# EAGLE board base-6u-at91sam7s-eval-r2 (EAGLE 4.16), part 1 of 2
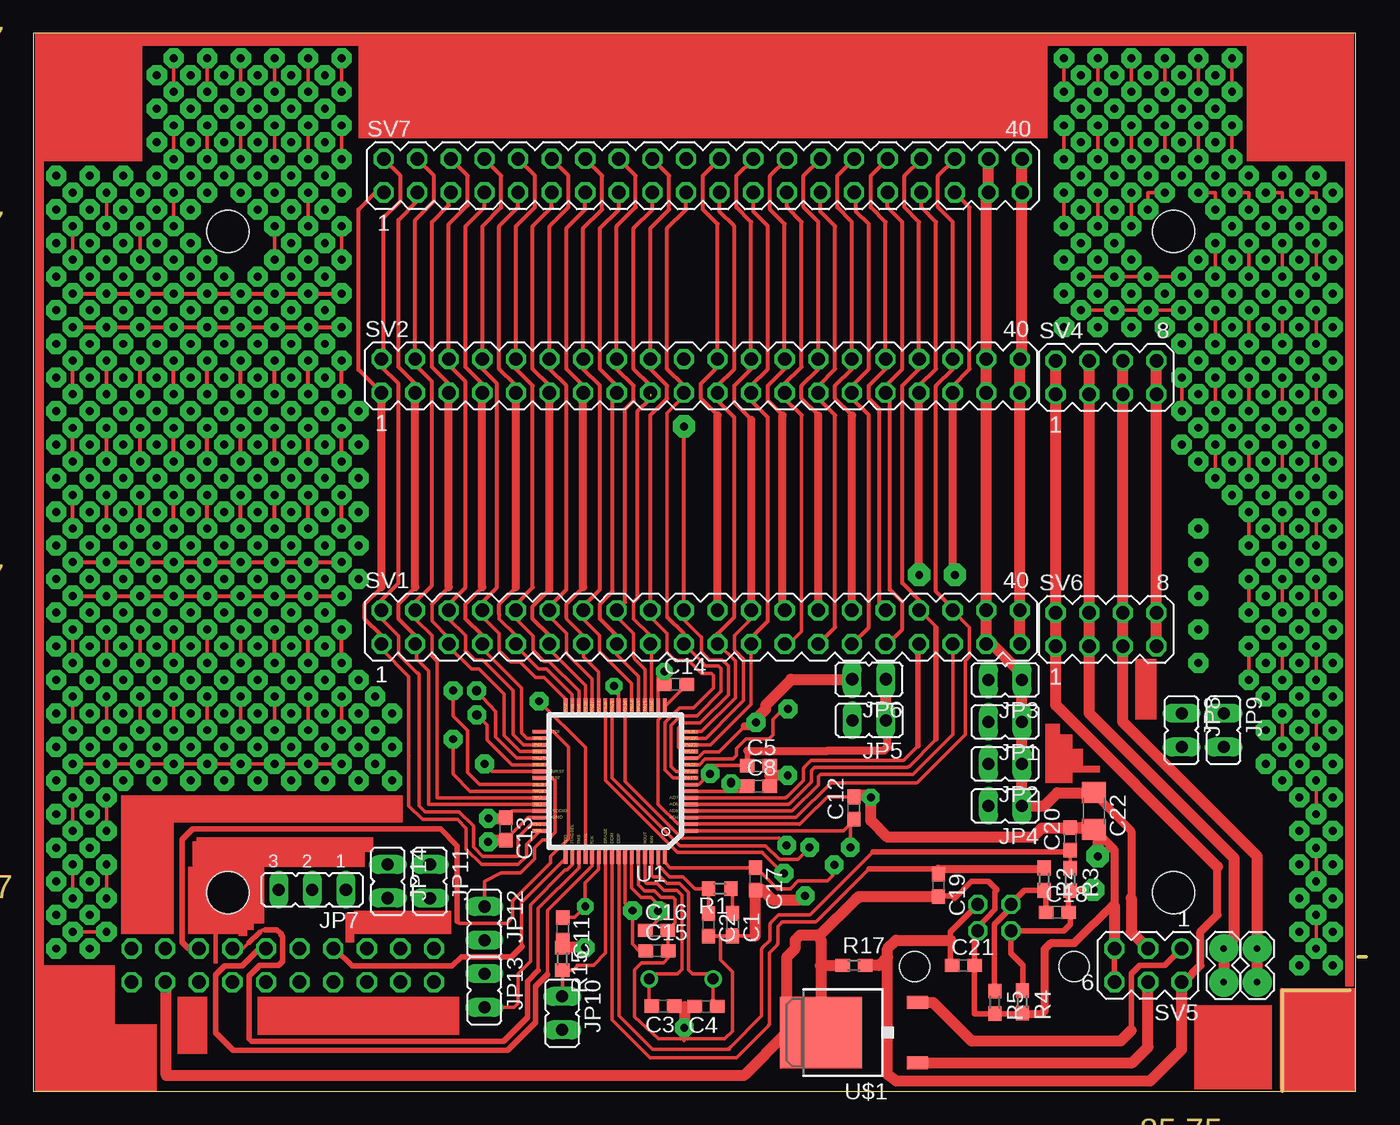
[diagram p1: board, top side]
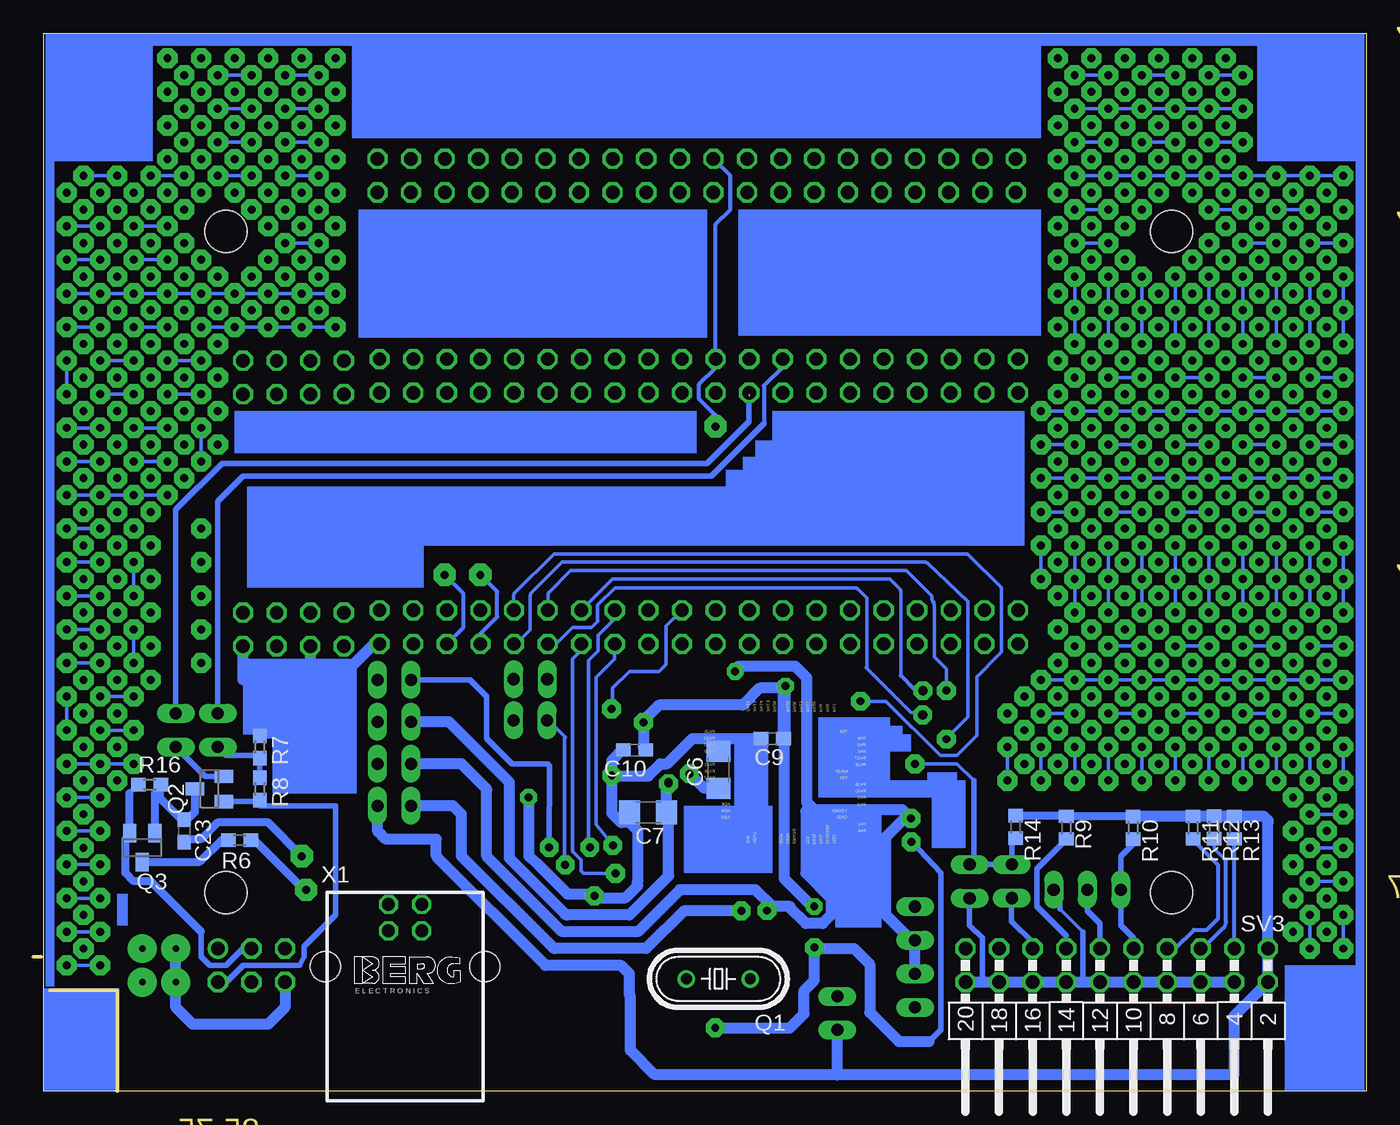
[diagram p2: board, bottom side, seen from below]

Size 100.8 x 80.01 mm. Coordinates in mm from the lower left corner, seen from the top.
Outline: 100.16,10.16 100.8,10.16
Outline: 99.53,7.62 94.45,7.62 94.45,0
Outline: 0,0.01 100,0.01 100,80.01 0,80.01 0,0.01
Copper layers (1*16): Top 0.035mm / dielectric 1.5mm / Bottom 0.035mm
Design rules "default": minimum track width 10mil, minimum drill 24mil, track to track 8mil, track to pad 8mil, pad to pad 8mil, via to via 8mil, smd to smd 8mil, copper to edge 40mil, drill to drill 8mil, minimum pad ring 10mil, minimum via ring 8mil, stop-mask expansion 4mil, vias tented up to drill 0mil, thermal gap 10mil
Holes 3.2 mm at 14.72,15.02 14.72,65.01 86.22,15.02 86.22,65.01

## Footprints (pad centres in the part's own frame; a part is rotated, then mirrored left to right if it is on the bottom)
C0603 = smd 1.1 x 1: 1 -0.85,0; 2 0.85,0
C1206 = smd 1.6 x 1.8: 1 -1.4,0; 2 1.4,0
JP1 = drill 0.914 long: 1 0,-1.27; 2 0,1.27
JP2 = drill 0.914 long: 1 -2.54,0; 2 0,0; 3 2.54,0
HC49/S = drill 0.813 round: 1 -2.413,0; 2 2.413,0
SOT23 = smd 1 x 1.4: 1 -0.95,-1.1; 2 0.95,-1.1; 3 0,1.1
R0603 = smd 1 x 1.1: 1 -0.85,0; 2 0.85,0
R0603' = smd 1.1 x 1: 1 -0.85,0; 2 0.85,0
MA20-2 = drill 1.016 octagon: 1 -24.13,-1.27; 2 -24.13,1.27; 3 -21.59,-1.27; 4 -21.59,1.27; 5 -19.05,-1.27; 6 -19.05,1.27; 7 -16.51,-1.27; 8 -16.51,1.27; 9 -13.97,-1.27; 10 -13.97,1.27; 11 -11.43,-1.27; 12 -11.43,1.27; 13 -8.89,-1.27; 14 -8.89,1.27; 15 -6.35,-1.27; 16 -6.35,1.27; 17 -3.81,-1.27; 18 -3.81,1.27; 19 -1.27,-1.27; 20 -1.27,1.27; 21 1.27,-1.27; 22 1.27,1.27; 23 3.81,-1.27; 24 3.81,1.27; 25 6.35,-1.27; 26 6.35,1.27; 27 8.89,-1.27; 28 8.89,1.27; 29 11.43,-1.27; 30 11.43,1.27; 31 13.97,-1.27; 32 13.97,1.27; 33 16.51,-1.27; 34 16.51,1.27; 35 19.05,-1.27; 36 19.05,1.27; 37 21.59,-1.27; 38 21.59,1.27; 39 24.13,-1.27; 40 24.13,1.27
MA10-2W = drill 1.016 octagon: 1 -11.43,-1.27; 2 -11.43,1.27; 3 -8.89,-1.27; 4 -8.89,1.27; 5 -6.35,-1.27; 6 -6.35,1.27; 7 -3.81,-1.27; 8 -3.81,1.27; 9 -1.27,-1.27; 10 -1.27,1.27; 11 1.27,-1.27; 12 1.27,1.27; 13 3.81,-1.27; 14 3.81,1.27; 15 6.35,-1.27; 16 6.35,1.27; 17 8.89,-1.27; 18 8.89,1.27; 19 11.43,-1.27; 20 11.43,1.27
MA04-2 = drill 1.016 octagon: 1 -3.81,-1.27; 2 -3.81,1.27; 3 -1.27,-1.27; 4 -1.27,1.27; 5 1.27,-1.27; 6 1.27,1.27; 7 3.81,-1.27; 8 3.81,1.27
MA03-2 = drill 1.016 round: 1 -2.54,-1.27 | drill 1.016 octagon: 2 -2.54,1.27; 3 0,-1.27; 4 0,1.27; 5 2.54,-1.27; 6 2.54,1.27
LQFP64 = smd 1.1 x 0.285: 1 -5.7,3.75; 2 -5.7,3.25; 3 -5.7,2.75; 4 -5.7,2.25; 5 -5.7,1.75; 6 -5.7,1.25; 7 -5.7,0.75; 8 -5.7,0.25; 9 -5.7,-0.25; 10 -5.7,-0.75; 11 -5.7,-1.25; 12 -5.7,-1.75; 13 -5.7,-2.25; 14 -5.7,-2.75; 15 -5.7,-3.25; 16 -5.7,-3.75; 33 5.7,-3.75; 34 5.7,-3.25; 35 5.7,-2.75; 36 5.7,-2.25; 37 5.7,-1.75; 38 5.7,-1.25; 39 5.7,-0.75; 40 5.7,-0.25; 41 5.7,0.25; 42 5.7,0.75; 43 5.7,1.25; 44 5.7,1.75; 45 5.7,2.25; 46 5.7,2.75; 47 5.7,3.25; 48 5.7,3.75 | smd 0.285 x 1.1: 17 -3.75,-5.7; 18 -3.25,-5.7; 19 -2.75,-5.7; 20 -2.25,-5.7; 21 -1.75,-5.7; 22 -1.25,-5.7; 23 -0.75,-5.7; 24 -0.25,-5.7; 25 0.25,-5.7; 26 0.75,-5.7; 27 1.25,-5.7; 28 1.75,-5.7; 29 2.25,-5.7; 30 2.75,-5.7; 31 3.25,-5.7; 32 3.75,-5.7; 49 3.75,5.7; 50 3.25,5.7; 51 2.75,5.7; 52 2.25,5.7; 53 1.75,5.7; 54 1.25,5.7; 55 0.75,5.7; 56 0.25,5.7; 57 -0.25,5.7; 58 -0.75,5.7; 59 -1.25,5.7; 60 -1.75,5.7; 61 -2.25,5.7; 62 -2.75,5.7; 63 -3.25,5.7; 64 -3.75,5.7
TO-252 = smd 1 x 1.6: 1 -2.28,-6.07; 2 2.28,-6.07 | smd 5.4 x 6.2: 3 0,1.23
MA02-1 = drill 0.5 pad 2.184 round: 1 -1.27,0; 2 1.27,0
PN61729 = drill 0.95 octagon: 1 1.25,4.71; 2 -1.25,4.71; 3 -1.25,2.71; 4 1.25,2.71 | hole 2.3: -6.02,0; 6.02,0

## Placement (x,y rotation side)
C1  1nF  [C0603]  52.88,12.61 270 top
C2  10nF  [C0603]  51.05,12.57 270 top
C3  10pF  [C0603]  47.63,6.46 180 top
C4  10pF  [C0603]  50.87,6.42 180 top
C5  1nF  [C0603]  54.85,24.62 0 top
C6  2.2uF  [C1206]  48.99,24.32 90 bottom
C7  4.7uF  [C1206]  54.31,21.1 180 bottom
C8  100nF  [C0603]  54.85,23.08 0 top
C9  100nF  [C0603]  44.92,26.67 180 bottom
C10  100nF  [C0603]  55.31,25.81 180 bottom
C11  100nF  [C0603]  40.05,12.3 270 top
C12  100nF  [C0603]  62.05,21.41 90 top
C13  100nF  [C0603]  35.73,19.85 270 top
C14  100nF  [C0603]  48.57,30.77 0 top
C15  100nF  [C0603]  47.16,10.63 0 top
C16  100nF  [C0603]  47.14,12.16 0 top
C17  100nF  [C0603]  54.62,16.05 270 top
C18  33pF  [C0603]  77.42,13.54 0 top
C19  15pF  [C0603]  68.44,15.58 270 top
C20  15pF  [C0603]  78.41,19.1 90 top
C21  100nF  [C0603]  70.32,9.53 0 top
C22  2.2uF  [C1206]  80.2,21.2 270 top
C23  10nF  [C0603]  89.37,19.69 270 bottom
JP1  [JP1]  73.5,27.94 90 top
JP2  [JP1]  73.5,24.77 90 top
JP3  [JP1]  73.5,31.12 90 top
JP4  [JP1]  73.5,21.59 90 top
JP5  [JP1]  63.2,28.05 90 top
JP6  [JP1]  63.19,31.16 90 top
JP7  [JP2]  21.11,15.24 180 top
JP8  [JP1]  86.83,27.31 180 top
JP9  [JP1]  90,27.31 180 top
JP10  [JP1]  40,5.91 180 top
JP11  [JP1]  30,15.88 180 top
JP12  [JP1]  34.12,12.7 180 top
JP13  [JP1]  34.12,7.62 180 top
JP14  [JP1]  26.82,15.88 180 top
Q1  18.432MHz  [HC49/S]  48.99,8.51 180 bottom
Q2  BSS123  [SOT23]  87.47,22.86 90 bottom
Q3  BSS84  [SOT23]  92.55,18.42 180 bottom
R1  1.5k  [R0603]  51.91,15.32 180 top
R2  27  [R0603']  76.43,16.05 270 top
R3  27  [R0603']  78.4,16.03 270 top
R4  330k  [R0603']  74.78,6.76 270 top
R5  330k  [R0603']  72.7,6.71 270 top
R6  1.5k  [R0603']  85.19,18.99 180 bottom
R7  47k  [R0603']  83.66,26.04 270 bottom
R8  27k  [R0603']  83.66,22.86 270 bottom
R9  47k  [R0603]  22.68,19.93 270 bottom
R10  47k  [R0603]  17.63,19.93 270 bottom
R11  47k  [R0603]  13.09,19.93 270 bottom
R12  47k  [R0603]  11.53,19.96 270 bottom
R13  47k  [R0603]  9.99,19.95 270 bottom
R14  10k  [R0603]  26.52,19.99 270 bottom
R15  1.5k  [R0603]  40.02,10.03 270 top
R16  100k  [R0603']  91.97,23.19 0 bottom
R17  10k  [R0603']  62.06,9.53 0 top
SV1  [MA20-2]  50.47,35.09 0 top
SV2  [MA20-2]  50.47,54.09 0 top
SV3  JTAG/ICE  [MA10-2W]  18.88,9.52 180 bottom
SV4  [MA04-2]  81.11,53.98 0 top
SV5  [MA03-2]  84.29,9.53 180 top
SV6  [MA04-2]  81.11,34.92 0 top
SV7  [MA20-2]  50.63,69.24 0 top
U1  [LQFP64]  44.01,23.45 180 top
U$1  LF33CDT  [TO-252]  60.8,4.45 90 top
U$2  MA02-1  [MA02-1]  90,9.53 90 top
U$3  MA02-1  [MA02-1]  92.55,9.53 90 top
X1  [PN61729]  72.67,9.42 0 bottom

## Tracks (layer width: path | path; a pad name or v marks a point on that pad's centre or on a via)
AD4
  Top 0.254: U1.3 57.68,20.7 60.32,23.34 66.83,23.34 70.48,26.99 70.48,32.54 70.8,32.86 70.8,35.08 SV1.36
  Top 0.305: SV1.36 69.52,36.51 69.53,36.51 68.26,37.78 68.26,53.34 69.52,54.61 SV2.36 69.52,65.73 68.41,66.83 68.41,69.22 69.69,70.48 69.68,70.49 SV7.36
AD5  (via drill 0.6 pad 1.68)
  Top 0.254: 69.48,33.78 SV1.35 69.53,26.99 66.51,23.97 59.52,23.97 59.37,23.81 59.37,23.18 57.38,21.2 U1.4
  Top 0.305: SV2.35 69.52,53.34 70.8,54.61 70.8,66.83 69.68,67.95 SV7.35 | v69.69,39.05 69.53,38.89
  Top 0.61: 69.53,38.89 SV2.35
  Bottom 0.305: SV1.35 68.26,35.09 68.26,37.62 v69.69,39.05
AD6
  Top 0.254: SV1.34 SV1.34 arc45 67.01,36.38 67.02,36.38 68.2,35.21 arc-45 68.27,35.03 | U1.5 57.03,21.7 arc45 57.21,21.77 58.85,23.41 58.85,24.16 arc-45 58.92,24.34 59.09,24.51 66.05,24.51 arc45 66.23,24.58 68.18,26.53 arc-45 68.19,26.54 68.27,26.62
  Top 0.305: 66.99,36.51 66.98,36.51 SV1.34 | SV1.34 | SV1.34 66.99,37.15 65.72,38.42 65.72,53.34 66.98,54.61 SV2.34 66.98,65.73 65.88,66.83 65.88,69.22 67.14,70.48 67.14,70.49 SV7.34
  Top 0.406: 68.27,26.62 68.27,35.03
AD7  (via drill 0.6 pad 1.68)
  Top 0.254: SV1.33 67,33.82 66.91,33.73 | U1.6 56.8,22.2 arc45 56.98,22.27 58.24,23.53 58.24,24.33 arc-45 58.31,24.51 58.81,25.01 65.7,25.01 arc45 65.88,25.08 66.91,26.11 66.91,26.1
  Top 0.305: SV2.33 66.99,53.34 68.26,54.61 68.26,65.72 67.14,66.83 67.14,67.95 SV7.33
  Top 0.406: 66.91,26.11 66.91,33.73
  Top 0.61: v66.99,39.05 SV2.33
  Bottom 0.305: SV1.33 66.98,34.61 65.72,35.88 65.72,37.78 v66.99,39.05
ADVREF  (via drill 0.6 pad 1.42)
  Top 0.254: v61.78,18.46 61.78,20.19 62.06,20.48 | 62.06,20.48 62.05,20.49 C12.1 | U1.1 61.28,19.7 62.06,20.48
  Bottom 0.406: v61.78,18.46 61.76,24.62 61.91,24.77 64.61,24.77 66.51,26.67 66.51,29.85 67.78,31.12 JP3.2
DDM
  Top 0.254: U1.56 43.76,5.4 46.63,2.54 46.82,2.54 53.17,2.54 55.59,4.95 arc45 55.66,5.13 55.66,10.48 56.23,11.05 arc45 56.3,11.23 56.3,12.48 56.57,12.75 arc-45 56.74,12.82 59.19,12.82 63.19,16.83 | 68.41,16.83 68.41,16.46 C19.1 | 76.36,16.83 R2.1
  Top 0.406: 63.19,16.83 68.41,16.83
  Top 0.61: 68.41,16.83 76.36,16.83
DDP
  Top 0.254: 44.28,17.71 44.28,5.72 46.82,3.17 52.64,3.17 arc-45 52.71,3.35 55.08,5.71 55.08,10.69 arc-45 55.15,10.87 55.71,11.43 55.71,12.6 arc-45 55.79,12.77 56.35,13.33 58.73,13.33 63.49,18.1 | C20.1 78.45,18.25 78.36,18.16 | R3.1 78.42,16.88 78.41,16.89 C20.1 | 78.58,18.1 C20.1
  Top 0.305: U1.57 44.28,17.71
  Top 0.406: 63.49,18.1 78.58,18.1
GND  (via drill 0.6 pad 1.27, 0.6 pad 1.42, 0.6 pad 1.68)
  Top 0.254: 49.24,4.12 49.23,3.95 49.23,3.97 | 51.28,11.72 51.25,11.75 | 51.94,11.72 51.96,11.71 51.96,9.95 52.88,9.03 52.88,4.55 52.28,3.95 49.27,3.95 | 49.23,3.97 49.21,3.83 | 49.27,3.95 49.25,4.11 49.24,4.12 | 49.24,4.12 49.23,3.97 | C2.2 51.05,11.71 51.06,11.71 51.11,11.75 C1.2 | C1.2 52.91,11.75 52.92,11.74 52.9,11.72 51.94,11.72 | 51.94,11.72 51.28,11.72 | 51.94,11.72 51.9,11.72 51.88,11.74 51.86,11.72 51.28,11.72 | C17.2 54.58,15.17 54.58,11.73 54.57,11.74 C1.2 | C1.2 | C1.2 | 49.69,20.2 49.66,20.2 49.64,20.18 49.61,20.21 48.75,20.21 47.25,21.71 47.25,28.07 47.76,28.58 U1.17 47.83,29.15 49.45,30.77 C14.2 | C13.2 37.43,20.7 U1.46 | C5.2 55.7,23.89 C8.2 | 49.24,4.12 49.24,5.63 C4.2 49.26,6.42 48.5,6.42 48.49,6.42 48.48,6.42 C3.1 | 49.27,3.95 49.27,3.97 47.29,3.97 45.46,5.64 45.46,9.17 46,9.71 47.65,9.71 48.09,10.16 48,10.25 C15.2 48,10.66 47.99,10.67 47.99,10.68 C16.2 47.99,12.2 47.99,12.21 48.53,12.74 48.53,14.52 48.38,14.66 47.47,14.66 46.97,15.16 46.21,15.16 45.76,15.62 U1.60 | 80.48,19.89 80.48,19.69 80.44,19.73 arc45 80.26,19.8 C22.2 | C11.2 40.02,11.42 R15.1 | 49.69,20.2 U1.2 | 57.95,20.21 U1.2 49.69,20.2 | 57.95,20.21 57.98,20.21 | 57.95,20.21 57.95,20.19 59.2,21.43 59.21,21.43 60.04,22.26 C12.2 62.05,22.37 | 62.05,22.37 62.06,22.38 | 61.97,22.36 62.04,22.36 62.05,22.37 | v63.34,22.23 63.34,22.36
  Top 0.406: SV3.18 | SV3.16 | SV3.14 | SV3.10 | SV3.12 | SV3.6 | SV3.8 | SV3.20 | C19.2 68.45,14.79 69.5,14.79 69.69,14.61 70.95,15.88 72.22,15.88 72.86,15.24 72.86,15.23 72.7,15.07 72.72,13.74 71.42,12.39 X1.4 71.17,11.88 C21.2 71.17,5.87 R5.2 | R5.2 | R4.2 74.78,5.87 R5.2 | SV5.5 SV5.6 | 81.62,14.1 81.75,13.97 | 81.77,18.26 80.95,18.26 v80.48,17.78
  Top 0.61: C17.2 54.65,15.24 | R4.2 74.65,5.92 74.64,5.9 74.68,5.87 76.28,5.87 76.49,6.08 76.49,10.75 76.96,11.22 78.73,11.22 80.2,12.7 80.22,12.7 81.62,14.1 81.77,14.25 81.77,18.26 80.22,19.8 C22.2
  Top 0.813: v57.05,23.89 55.7,23.89 | 80.48,19.89 C20.2 | 80.48,19.89 76.23,19.89 75.56,19.21 65.37,19.21 64.61,19.21 63.34,20.48 v63.34,22.23 | 63.34,22.36 61.97,22.36 | 54.58,11.73 54.58,14.74 55.08,15.24 55.14,15.24 55.94,14.45 57.93,14.45 v58.37,14.79 | v41.73,10.88 R15.1 | 49.26,6.42 49.23,6.38 v49.23,4.79 | C13.2 34.48,19 v34.41,18.87 | 59.49,11.82 58.12,11.82 arc45 57.94,11.75 57.62,11.43 57.62,10.9 arc-45 57.55,10.72 56.98,10.16 56.98,4.55 arc-45 56.91,4.37 53.81,1.27 arc-45 53.63,1.2 10.07,1.2 10.07,8.18 SV3.4 | 68.41,14.61 68.41,14.67 arc-45 C19.2 | 59.49,11.82 62.2,14.53 | 62.2,14.53 arc-45 62.38,14.61 | C19.2 | C19.2 | 62.2,14.53 62.4,14.73 C19.2 | 80.48,19.89 80.48,18.42 | 59.49,11.82 59.49,11.46 59.56,11.39 59.56,9.53 | 59.56,9.53 U$1.3 | 59.56,9.53 59.52,9.53 | 59.56,9.53 R17.1 | U$2.1 U$2.2 90.8,11.59 90.8,17.62 79.84,28.58 | SV6.7 SV6.8 SV4.7 84.92,52.73 84.94,52.74 84.92,52.76 SV4.8 | 79.84,28.58 SV6.3 SV6.4 SV4.3 SV4.4 | 74.61,36.2 74.6,36.2 SV1.40 SV1.39 74.6,36.19 74.61,36.2 | SV2.39 | SV2.39 74.6,55.31 74.56,55.35 74.57,55.36 SV2.40 74.76,55.53 SV7.39 | 74.61,36.2 SV2.39 | SV7.39 74.76,67.95 74.77,67.95 | SV7.39 SV7.40 | 79.84,28.58 | 81.75,13.97 SV5.5
  Bottom 0.254: 34.76,19.05 34.57,18.87 v34.41,18.87 | SV3.6 | SV3.8 | SV3.10 | SV3.12 | SV3.16 | SV3.18 | SV3.20 | 21.42,12.06 23.17,13.81 | 23.17,14.76 JP7.1
  Bottom 0.305: 74.61,55.4 74.6,55.4 SV2.40
  Bottom 0.406: v41.74,10.88 41.78,10.83 | v41.73,10.88 v41.74,10.88 | v41.74,10.88 41.57,11.04 | R7.1 80.69,26.89 80.69,27.09 79.84,27.94 79.84,31.12 SV6.3 | 89.37,19.05 C23.2 89.37,18.86 89.17,19.05 | 33.05,3.78 32.17,4.66 32.17,16.5 34.37,18.87 | C7.2 55.71,20.96 55.71,20.32 | 29.04,8.25 29.04,11.59 30,12.54 JP11.2 | 21.42,8.25 21.42,12.06 | 23.17,13.81 23.17,14.76
  Bottom 0.61: v80.48,17.78 83.02,20.32 86.83,20.32 88.1,19.05 89.17,19.05
  Bottom 0.813: 55.08,15.9 55.08,15.88 | 55.08,15.9 55.08,19.69 55.71,20.32 56.35,20.32 57.05,21.02 57.05,21.66 57.04,21.67 v57.04,23.89 v57.05,23.89 | 55.08,15.9 55.1,15.9 55.1,15.54 56,14.64 58.16,14.64 58.39,14.88 58.38,14.88 v58.37,14.79 58.37,14.91 58.36,14.92 60.4,14.92 62.62,17.15 63.34,17.78 v63.34,22.23 | v49.23,4.79 43.59,4.79 42.52,5.87 42.52,7.62 41.73,8.4 v41.73,10.88 41.73,10.81 41.74,10.79 38.75,10.79 37.55,9.6 37.55,5.96 35.36,3.78 33.05,3.78 | 79.81,33.79 79.84,33.76 SV6.3 79.84,31.75 80.48,31.12 84.92,31.12 SV6.7 | U$2.2 90,6.35 88.73,5.08 83.02,5.08 81.75,6.35 SV5.6 | SV3.12 SV3.10 SV3.8 SV3.6 SV3.4 | SV3.12 21.42,8.25 SV3.14 SV3.16 SV3.18 29.04,8.25 SV3.20 | SV1.39 75.01,33.82 77.73,31.11 79.87,31.11 79.89,31.12 79.84,31.12 | 34.37,18.87 v34.41,18.87 | 49.05,26.67 50.95,26.67 52.86,24.77 53.38,24.77 54.3,23.85 57.02,23.85 v57.06,23.89 | 49.05,26.67 C9.2 | v57.06,23.89 57.07,23.9 | v57.05,23.89 v57.06,23.89 | 49.05,26.67 49.05,26.35 48.99,26.3 C6.2 | C10.2 56.16,25.85 56.19,25.88 57.05,25.02 v57.05,23.89
JTAGSEL
  Top 0.254: JP13.2 36.35,6.35 36.66,6.67 36.66,8.89 37.6,9.82 37.6,14.11 40.23,16.74 40.38,16.74 40.79,17.15 40.79,17.62 40.76,17.65 U1.50
N$1
  Top 0.254: Q1.2 51.41,8.58 | Q1.2 | U1.62 46.76,16.32 46.86,16.21 47.42,16.21 47.91,15.72 48.88,15.72 49.55,15.05 49.55,9.19 49.84,8.89 51.1,8.89 51.43,8.56 51.4,8.54 Q1.2 | Q1.2 51.4,8.55 | 51.83,6.42 51.91,6.35 | C4.1 51.83,6.42 | Q1.2 51.41,6.84 51.83,6.42
N$2
  Top 0.254: U1.61 46.25,17.79 | U1.61 | U1.61 46.25,15.86 46.39,15.71 47.18,15.71 47.69,15.21 48.67,15.21 49.06,14.81 49.06,9.22 48.73,8.89 46.98,8.89 Q1.1 | Q1.1 | 46.78,6.39 46.82,6.35 | C3.2 46.78,6.39 | Q1.1 46.58,6.59 46.78,6.39
N$3
  Top 0.254: 52.73,15.32 | 52.73,15.32 R1.1 | C1.1 52.88,15.17 52.73,15.32
N$4
  Top 0.305: R2.2 76.41,15.19 76.57,15.03
  Top 0.406: R5.1 72.67,7.58 72.67,12.62 73.92,13.88 X1.2 73.92,14.17 74.94,15.19 76.3,15.19 76.35,15.24 76.4,15.2 R2.2 | R2.2 76.41,15.22 | C18.1 76.57,15.06 R2.2
N$5  (via drill 0.6 pad 1.68)
  Top 0.406: R4.1 74.81,7.64 74.81,9.54 73.92,10.42 X1.3 77.93,12.13 78.43,12.63 78.43,13.39 78.29,13.54 C18.2 | 78.29,13.48 78.27,13.5 C18.2 | C18.2 78.27,15.04 R3.2 78.51,15.17 78.58,15.24 v80.16,15.24
  Bottom 0.406: 84.29,19.05 R6.1 84.2,18.99 84.13,19.05 | v80.16,15.24 80.32,15.24
  Bottom 0.61: 80.32,15.24 84.13,19.05
N$6  (via drill 0.6 pad 1.52)
  other vias: 23.33,67.95
N$7
  Bottom 0.406: 86.55,18.98 86.13,18.99 R6.2
  Bottom 0.61: Q3.3 88.25,17.32 86.55,18.98
N$8  (via drill 0.6 pad 1.52)
  Top 0.254: v23.33,70.48 v23.33,73.03
N$9
  Bottom 0.254: SV3.15 25.23,11.27 | JP14.2
  Bottom 0.406: 25.23,11.27 26.82,12.86 JP14.2
N$10  (via drill 0.6 pad 1.52)
  Top 0.254: v20.79,70.48 v20.79,73.03
N$11
  Top 0.813: U$1.1 83.12,2.17 84.29,3.33 SV5.4
N$12
  Top 0.406: SV5.1 85.56,9.53 83.66,9.53 83.02,8.89 83.02,4.6
  Top 0.813: U$1.2 68.04,6.72 70.95,3.81 82.23,3.81 83.02,4.6
N$13
  Bottom 0.254: SV3.3
  Bottom 0.305: SV3.3 R13.2
N$15
  Top 0.254: R15.2 39.99,9.17 39.97,9.15 40.23,8.89 | JP10.1 | JP10.1 | R15.2 40.02,7.2 JP10.1 | 40.01,9.1 40.02,9.1 R15.2 | 40,9.14 40.02,9.16 R15.2 | 40,9.14 40.82,9.14 41.12,9.45 41.12,9.52 41.11,9.53 42.35,9.53 43.26,10.46 U1.55 | 40,9.14 39.98,9.12
N$16
  Bottom 0.254: JP7.2 21.11,15.4
  Bottom 0.406: SV3.11 20.15,12.7 21.11,13.65 JP7.2
N$17
  Bottom 0.406: 91.59,22.54 91.12,23.02 R16.2 91.12,22.07 | 89.37,20.32 C23.1
  Bottom 0.61: 91.59,22.54 Q3.1 | 91.12,22.07 89.37,20.32 88.56,21.12 Q2.3
N$18  (via drill 0.6 pad 1.52)
  other vias: 18.25,67.95
N$19  (via drill 0.6 pad 1.52)
  Top 0.254: v18.25,70.48 v18.25,73.03
N$20  (via drill 0.6 pad 1.52)
  Top 0.254: v15.71,70.48 v15.71,73.03
N$21  (via drill 0.6 pad 1.52)
  other vias: 15.71,67.95
N$23  (via drill 0.6 pad 1.52)
  Top 0.254: v20.79,65.41 v20.79,67.95
N$24  (via drill 0.6 pad 1.52)
  Top 0.254: v18.25,62.86 v18.25,65.41
N$25  (via drill 0.6 pad 1.52)
  Bottom 0.254: v79.21,64.14 v81.75,64.14
N$26  (via drill 0.6 pad 1.52)
  other vias: 20.79,62.86
N$27  (via drill 0.6 pad 1.52)
  Top 0.254: v23.33,62.86 v23.33,65.41
N$28  (via drill 0.6 pad 1.52)
  Top 0.254: v79.21,61.59 v86.83,61.59
N$29  (via drill 0.6 pad 1.52)
  Top 0.254: v79.21,59.05 v86.83,59.05
N$30  (via drill 0.6 pad 1.52)
  Bottom 0.254: v90.64,65.41 v93.18,65.41
N$31  (via drill 0.6 pad 1.52)
  Bottom 0.254: v95.72,65.41 v98.26,65.41
N$32  (via drill 0.6 pad 1.52)
  Top 0.254: v20.79,75.57 v20.79,78.11
N$33  (via drill 0.6 pad 1.52)
  Top 0.254: v23.33,75.57 v23.33,78.11
N$34  (via drill 0.6 pad 1.52)
  Top 0.254: v18.25,75.57 v18.25,78.11
N$35  (via drill 0.6 pad 1.52)
  other vias: 90.64,60.32
N$36  (via drill 0.6 pad 1.52)
  other vias: 93.18,60.32
N$37  (via drill 0.6 pad 1.52)
  Top 0.254: v15.71,75.57 v15.71,78.11
N$38  (via drill 0.6 pad 1.52)
  other vias: 95.72,60.32
N$40  (via drill 0.6 pad 1.52)
  other vias: 13.17,67.95
N$41  (via drill 0.6 pad 1.52)
  Bottom 0.254: v88.1,55.24 v90.64,55.24
N$42  (via drill 0.6 pad 1.52)
  Top 0.254: v13.17,70.48 v13.17,73.03
N$43  (via drill 0.6 pad 1.52)
  other vias: 83.02,57.78
N$44  (via drill 0.6 pad 1.52)
  Top 0.254: v13.17,75.57 v13.17,78.11
N$45  (via drill 0.6 pad 1.52)
  Bottom 0.254: v93.18,55.24 v95.72,55.24
N$46  (via drill 0.6 pad 1.52)
  other vias: 80.48,60.32
N$47  (via drill 0.6 pad 1.52)
  other vias: 80.48,62.86
N$48  (via drill 0.6 pad 1.52)
  Bottom 0.254: v79.21,69.22 v81.75,69.22
N$50  (via drill 0.6 pad 1.52)
  Bottom 0.254: v84.29,69.22 v86.83,69.22
N$52  (via drill 0.6 pad 1.52)
  Top 0.254: v10.63,75.57 v10.63,78.11
N$53  (via drill 0.6 pad 1.52)
  other vias: 89.37,71.76
N$54  (via drill 0.6 pad 1.52)
  Top 0.254: v10.63,70.48 v10.63,73.03
N$55  (via drill 0.6 pad 1.52)
  Bottom 0.254: v89.37,69.22 v91.91,69.22
N$56  (via drill 0.6 pad 1.52)
  other vias: 8.09,67.95
N$58  (via drill 0.6 pad 1.52)
  other vias: 89.37,74.3
N$59  (via drill 0.6 pad 1.52)
  Bottom 0.254: v84.29,74.3 v86.83,74.3
N$61  (via drill 0.6 pad 1.52)
  Bottom 0.254: v79.21,74.3 v81.75,74.3
N$62  (via drill 0.6 pad 1.52)
  Bottom 0.254: v77.94,60.32 v98.26,60.32
N$63  (via drill 0.6 pad 1.52)
  other vias: 85.56,60.32
N$64  (via drill 0.6 pad 1.52)
  other vias: 3.01,67.95
N$66  (via drill 0.6 pad 1.52)
  Top 0.254: v77.94,65.41 v77.94,67.95
N$84  (via drill 0.6 pad 1.52)
  other vias: 77.94,62.86
N$85  (via drill 0.6 pad 1.52)
  other vias: 80.48,57.78
N$88  (via drill 0.6 pad 1.52)
  other vias: 83.02,62.86
N$89  (via drill 0.6 pad 1.52)
  Top 0.254: v80.48,65.41 v80.48,67.95
N$91  (via drill 0.6 pad 1.52)
  Top 0.254: v77.94,70.48 v77.94,73.03
N$92  (via drill 0.6 pad 1.52)
  Top 0.254: v80.48,70.48 v80.48,73.03
N$93  (via drill 0.6 pad 1.52)
  Top 0.254: v83.02,70.48 v83.02,73.03
N$95  (via drill 0.6 pad 1.52)
  Top 0.254: v83.02,65.41 v83.02,67.95
N$97  (via drill 0.6 pad 1.52)
  other vias: 83.02,60.32
N$98  (via drill 0.6 pad 1.52)
  other vias: 85.56,57.78
N$101  (via drill 0.6 pad 1.52)
  other vias: 88.1,60.32
N$102  (via drill 0.6 pad 1.52)
  Bottom 0.254: v77.94,57.78 v88.1,57.78
N$104  (via drill 0.6 pad 1.52)
  Top 0.254: v88.1,67.95 89.37,67.95 v89.37,66.68
N$109  (via drill 0.6 pad 1.52)
  Top 0.254: v90.64,67.95 91.91,67.95 v91.91,66.68
N$110  (via drill 0.6 pad 1.52)
  Top 0.254: v90.64,70.48 v90.64,73.03
N$111  (via drill 0.6 pad 1.52)
  Top 0.254: v88.1,70.48 v88.1,73.03
N$112  (via drill 0.6 pad 1.52)
  Top 0.254: v85.56,70.48 v85.56,73.03
N$120  (via drill 0.6 pad 1.52)
  Top 0.254: v77.94,75.57 v77.94,78.11
N$122  (via drill 0.6 pad 1.52)
  Top 0.254: v80.48,75.57 v80.48,78.11
N$124  (via drill 0.6 pad 1.52)
  Top 0.254: v83.02,75.57 v83.02,78.11
N$126  (via drill 0.6 pad 1.52)
  Top 0.254: v85.56,75.57 v85.56,78.11
N$128  (via drill 0.6 pad 1.52)
  Top 0.254: v88.1,75.57 v88.1,78.11
N$129  (via drill 0.6 pad 1.52)
  Top 0.254: v90.64,75.57 v90.64,78.11
N$143  (via drill 0.6 pad 1.52)
  Top 0.254: v93.18,67.95 94.45,67.95 v94.45,66.68
N$146  (via drill 0.6 pad 1.52)
  Top 0.254: v95.72,67.95 96.99,67.95 v96.99,66.68
N$147  (via drill 0.6 pad 1.52)
  other vias: 98.26,67.95
N$153  (via drill 0.6 pad 1.52)
  Bottom 0.254: v95.72,62.86 v98.26,62.86
N$154  (via drill 0.6 pad 1.52)
  Bottom 0.254: v90.64,62.86 v93.18,62.86
N$155  (via drill 0.6 pad 1.52)
  Bottom 0.254: v90.64,57.78 v93.18,57.78
N$162  (via drill 0.6 pad 1.52)
  Bottom 0.254: v95.72,57.78 v98.26,57.78
N$163  (via drill 0.6 pad 1.52)
  Bottom 0.254: v88.1,52.7 v90.64,52.7
N$167  (via drill 0.6 pad 1.52)
  Bottom 0.254: v93.18,52.7 v95.72,52.7
N$169  (via drill 0.6 pad 1.52)
  Bottom 0.254: v90.64,47.62 v93.18,47.62
N$170  (via drill 0.6 pad 1.52)
  Bottom 0.254: v90.64,50.16 v93.18,50.16
N$171  (via drill 0.6 pad 1.52)
  other vias: 93.18,45.09
N$172  (via drill 0.6 pad 1.52)
  other vias: 93.18,42.54
N$174  (via drill 0.6 pad 1.52)
  Bottom 0.254: v93.18,37.46 v93.18,40
N$176  (via drill 0.6 pad 1.52)
  Bottom 0.254: v93.18,32.38 v93.18,34.92
N$177  (via drill 0.6 pad 1.52)
  Bottom 0.254: v93.18,29.85 v95.72,29.85
N$178  (via drill 0.6 pad 1.52)
  Bottom 0.254: v93.18,27.31 v95.72,27.31
N$179  (via drill 0.6 pad 1.52)
  Bottom 0.254: v93.18,24.77 v98.26,24.77
N$180  (via drill 0.6 pad 1.52)
  other vias: 95.72,24.77
N$182  (via drill 0.6 pad 1.52)
  Bottom 0.254: v98.26,27.31 v98.26,29.85
N$184  (via drill 0.6 pad 1.52)
  Bottom 0.254: v95.72,32.38 v98.26,32.38
N$188  (via drill 0.6 pad 1.52)
  Bottom 0.254: v95.72,42.54 v98.26,42.54
N$189  (via drill 0.6 pad 1.52)
  Bottom 0.254: v90.64,45.09 v98.26,45.09
N$190  (via drill 0.6 pad 1.52)
  other vias: 95.72,45.09
N$192  (via drill 0.6 pad 1.52)
  Bottom 0.254: v95.72,40 v98.26,40
N$193  (via drill 0.6 pad 1.52)
  Bottom 0.254: v95.72,37.46 v98.26,37.46
N$194  (via drill 0.6 pad 1.52)
  Bottom 0.254: v95.72,34.92 v98.26,34.92
N$195  (via drill 0.6 pad 1.52)
  Top 0.254: v94.45,36.2 v94.45,38.73
N$196  (via drill 0.6 pad 1.52)
  Top 0.254: v96.99,36.2 v96.99,38.73
N$202  (via drill 0.6 pad 1.52)
  Top 0.254: v94.45,31.12 v94.45,33.66
N$203  (via drill 0.6 pad 1.52)
  Top 0.254: v96.99,31.12 v96.99,33.66
N$207  (via drill 0.6 pad 1.52)
  Top 0.254: v96.99,26.04 v96.99,28.58
N$209  (via drill 0.6 pad 1.52)
  Top 0.254: v94.45,26.04 v94.45,28.58
N$211  (via drill 0.6 pad 1.52)
  other vias: 94.45,23.5
N$212  (via drill 0.6 pad 1.52)
  Bottom 0.254: v95.72,22.23 v98.26,22.23
N$214  (via drill 0.6 pad 1.52)
  Top 0.254: v96.99,20.96 v96.99,23.5
N$215  (via drill 0.6 pad 1.52)
  Bottom 0.254: v95.72,19.69 v98.26,19.69
N$219  (via drill 0.6 pad 1.52)
  Bottom 0.254: v95.72,17.15 v98.26,17.15
N$220  (via drill 0.6 pad 1.52)
  Top 0.254: v96.99,15.88 v96.99,18.42
N$221  (via drill 0.6 pad 1.52)
  Bottom 0.254: v95.72,14.61 v98.26,14.61
N$225  (via drill 0.6 pad 1.52)
  Bottom 0.254: v95.72,12.06 v98.26,12.06
N$226  (via drill 0.6 pad 1.52)
  Top 0.254: v96.99,10.79 v96.99,13.33
N$227  (via drill 0.6 pad 1.52)
  Bottom 0.254: v95.72,9.53 v98.26,9.53
N$229  (via drill 0.6 pad 1.52)
  other vias: 88.1,32.38
N$230  (via drill 0.6 pad 1.52)
  other vias: 88.1,34.92
N$231  (via drill 0.6 pad 1.52)
  other vias: 88.1,37.46
N$232  (via drill 0.6 pad 1.52)
  other vias: 88.1,40
N$233  (via drill 0.6 pad 1.52)
  other vias: 88.1,42.54
N$234  (via drill 0.6 pad 1.52)
  Top 0.254: v91.91,41.27 v91.91,43.81
N$236  (via drill 0.6 pad 1.52)
  Top 0.254: v91.91,36.2 v91.91,38.73
N$238  (via drill 0.6 pad 1.52)
  Top 0.254: v91.91,31.12 v91.91,33.66
N$240  (via drill 0.6 pad 1.52)
  Top 0.254: v94.45,41.27 v94.45,43.81
N$241  (via drill 0.6 pad 1.52)
  Top 0.254: v96.99,41.27 v96.99,43.81
N$244  (via drill 0.6 pad 1.52)
  Top 0.254: v91.91,46.35 v91.91,48.89
N$245  (via drill 0.6 pad 1.52)
  Top 0.254: v89.37,46.35 v89.37,48.89
N$247  (via drill 0.6 pad 1.52)
  Top 0.254: v94.45,46.35 v94.45,48.89
N$248  (via drill 0.6 pad 1.52)
  Top 0.254: v96.99,46.35 v96.99,48.89
N$249  (via drill 0.6 pad 1.52)
  Bottom 0.254: v95.72,47.62 v98.26,47.62
N$253  (via drill 0.6 pad 1.52)
  Bottom 0.254: v88.1,47.62 v88.1,50.16
N$254  (via drill 0.6 pad 1.52)
  other vias: 86.83,48.89
N$258  (via drill 0.6 pad 1.52)
  Top 0.254: v94.45,51.43 v94.45,53.98
N$259  (via drill 0.6 pad 1.52)
  Top 0.254: v96.99,51.43 v96.99,53.98
N$260  (via drill 0.6 pad 1.52)
  Bottom 0.254: v95.72,50.16 v98.26,50.16
N$261  (via drill 0.6 pad 1.52)
  Bottom 0.254: v98.26,52.7 v98.26,55.24
N$263  (via drill 0.6 pad 1.52)
  Top 0.254: v91.91,51.43 v91.91,53.98
N$264  (via drill 0.6 pad 1.52)
  Top 0.254: v89.37,51.43 v89.37,53.98
N$265  (via drill 0.6 pad 1.52)
  Top 0.254: v86.83,51.43 v86.83,53.98
N$269  (via drill 0.6 pad 1.52)
  other vias: 86.83,56.52
N$270  (via drill 0.6 pad 1.52)
  Top 0.254: v89.37,56.52 v89.37,59.05
N$271  (via drill 0.6 pad 1.52)
  Top 0.254: v91.91,56.52 v91.91,59.05
N$272  (via drill 0.6 pad 1.52)
  Top 0.254: v94.45,56.52 v94.45,59.05
N$275  (via drill 0.6 pad 1.52)
  Top 0.254: v96.99,56.52 v96.99,59.05
N$278  (via drill 0.6 pad 1.52)
  Top 0.254: v94.45,61.59 v94.45,64.14
N$279  (via drill 0.6 pad 1.52)
  Top 0.254: v96.99,61.59 v96.99,64.14
N$283  (via drill 0.6 pad 1.52)
  Top 0.254: v91.91,61.59 v91.91,64.14
N$286  (via drill 0.6 pad 1.52)
  Top 0.254: v89.37,61.59 v89.37,64.14
N$289  (via drill 0.6 pad 1.52)
  other vias: 88.1,62.86
N$293  (via drill 0.6 pad 1.52)
  Bottom 0.254: v94.45,69.22 v96.99,69.22
N$295  (via drill 0.6 pad 1.52)
  other vias: 84.29,61.59
N$296  (via drill 0.6 pad 1.52)
  other vias: 81.75,61.59
N$297  (via drill 0.6 pad 1.52)
  other vias: 81.75,59.05
N$298  (via drill 0.6 pad 1.52)
  other vias: 84.29,59.05
N$301  (via drill 0.6 pad 1.52)
  other vias: 79.21,66.68
N$303  (via drill 0.6 pad 1.52)
  Bottom 0.254: v79.21,71.76 v81.75,71.76
N$306  (via drill 0.6 pad 1.52)
  other vias: 81.75,66.68
N$307  (via drill 0.6 pad 1.52)
  Top 0.254: v84.29,66.68 84.29,67.95 v85.56,67.95
N$308  (via drill 0.6 pad 1.52)
  Bottom 0.254: v84.29,71.76 v86.83,71.76
N$315  (via drill 0.6 pad 1.52)
  Bottom 0.254: v79.21,76.84 v81.75,76.84
N$321  (via drill 0.6 pad 1.52)
  Bottom 0.254: v84.29,76.84 v86.83,76.84
N$327  (via drill 0.6 pad 1.52)
  other vias: 89.37,76.84
N$338  (via drill 0.6 pad 1.52)
  other vias: 18.25,60.32
N$339  (via drill 0.6 pad 1.52)
  Bottom 0.254: v19.52,56.52 v19.52,61.59
N$340  (via drill 0.6 pad 1.52)
  other vias: 19.52,59.05
N$341  (via drill 0.6 pad 1.52)
  other vias: 18.25,57.78
N$345  (via drill 0.6 pad 1.52)
  Top 0.305: v18.25,52.7 v18.25,55.24
N$346  (via drill 0.6 pad 1.52)
  other vias: 19.52,51.43
N$347  (via drill 0.6 pad 1.52)
  Top 0.305: v20.79,52.7 v20.79,55.24
N$349  (via drill 0.6 pad 1.52)
  other vias: 20.79,57.78
N$350  (via drill 0.6 pad 1.52)
  other vias: 20.79,60.32
N$351  (via drill 0.6 pad 1.52)
  Bottom 0.254: v22.06,56.52 v22.06,61.59
N$352  (via drill 0.6 pad 1.52)
  other vias: 22.06,59.05
N$354  (via drill 0.6 pad 1.52)
  Top 0.305: v23.33,57.78 v5.55,57.78 v3.01,57.78
N$356  (via drill 0.6 pad 1.52)
  Top 0.305: v23.33,52.7 v23.33,55.24
N$358  (via drill 0.6 pad 1.52)
  Top 0.305: v23.33,47.62 v23.33,50.16
N$360  (via drill 0.6 pad 1.52)
  Top 0.305: v23.33,42.54 v23.33,45.09
N$362  (via drill 0.6 pad 1.52)
  Top 0.305: v3.01,37.46 v23.33,37.46
N$363  (via drill 0.6 pad 1.52)
  Bottom 0.254: v24.6,38.73 v24.6,41.27
N$367  (via drill 0.6 pad 1.52)
  Bottom 0.254: v22.06,48.89 v24.6,48.89
N$368  (via drill 0.6 pad 1.52)
  Bottom 0.254: v1.74,51.43 v24.6,51.43
N$369  (via drill 0.6 pad 1.52)
  other vias: 22.06,53.98
N$372  (via drill 0.6 pad 1.52)
  Bottom 0.254: v19.52,64.14 v22.06,64.14
N$374  (via drill 0.6 pad 1.52)
  other vias: 19.52,69.22
N$375  (via drill 0.6 pad 1.52)
  Bottom 0.254: v19.52,71.76 v22.06,71.76
N$376  (via drill 0.6 pad 1.52)
  other vias: 19.52,74.3
N$378  (via drill 0.6 pad 1.52)
  Bottom 0.254: v19.52,66.68 v22.06,66.68
N$382  (via drill 0.6 pad 1.52)
  Bottom 0.254: v19.52,76.84 v22.06,76.84
N$383  (via drill 0.6 pad 1.52)
  other vias: 16.98,66.68
N$384  (via drill 0.6 pad 1.52)
  Bottom 0.254: v16.98,56.52 v16.98,61.59
N$385  (via drill 0.6 pad 1.52)
  Bottom 0.254: v14.44,56.52 v14.44,61.59
N$386  (via drill 0.6 pad 1.52)
  Bottom 0.254: v11.9,56.52 v11.9,61.59
N$387  (via drill 0.6 pad 1.52)
  other vias: 11.9,64.14
N$389  (via drill 0.6 pad 1.52)
  other vias: 11.9,69.22
N$391  (via drill 0.6 pad 1.52)
  other vias: 11.9,74.3
N$393  (via drill 0.6 pad 1.52)
  Bottom 0.254: v14.44,76.84 v16.98,76.84
N$395  (via drill 0.6 pad 1.52)
  other vias: 16.98,74.3
N$397  (via drill 0.6 pad 1.52)
  other vias: 16.98,69.22
N$398  (via drill 0.6 pad 1.52)
  other vias: 14.44,69.22
N$399  (via drill 0.6 pad 1.52)
  Bottom 0.254: v14.44,71.76 v16.98,71.76
N$400  (via drill 0.6 pad 1.52)
  other vias: 14.44,74.3
N$402  (via drill 0.6 pad 1.52)
  Top 0.254: v3.01,62.86 v3.01,65.41
N$403  (via drill 0.6 pad 1.52)
  Top 0.305: v3.01,60.32 v23.33,60.32
N$405  (via drill 0.6 pad 1.52)
  Top 0.305: v3.01,52.7 v3.01,55.24
N$408  (via drill 0.6 pad 1.52)
  Top 0.305: v3.01,47.62 v3.01,50.16
N$409  (via drill 0.6 pad 1.52)
  Top 0.305: v3.01,42.54 v3.01,45.09
N$411  (via drill 0.6 pad 1.52)
  Top 0.305: v3.01,40 v23.33,40
N$413  (via drill 0.6 pad 1.52)
  Top 0.254: v3.01,32.38 v3.01,34.92
N$415  (via drill 0.6 pad 1.52)
  Top 0.254: v3.01,27.31 v3.01,29.85
N$417  (via drill 0.6 pad 1.52)
  Top 0.254: v3.01,24.77 v23.33,24.77
N$418  (via drill 0.6 pad 1.52)
  Top 0.254: v3.01,19.69 v3.01,22.23
N$420  (via drill 0.6 pad 1.52)
  Top 0.254: v3.01,14.61 v3.01,17.15
N$423  (via drill 0.6 pad 1.52)
  Top 0.254: v5.55,19.69 v5.55,22.23
N$426  (via drill 0.6 pad 1.52)
  Top 0.254: v5.55,14.61 v5.55,17.15
N$427  (via drill 0.6 pad 1.52)
  other vias: 22.06,51.43
N$430  (via drill 0.6 pad 1.52)
  other vias: 22.06,46.35
N$431  (via drill 0.6 pad 1.52)
  Bottom 0.254: v22.06,43.81 v24.6,43.81
N$433  (via drill 0.6 pad 1.52)
  other vias: 22.06,38.73
N$434  (via drill 0.6 pad 1.52)
  other vias: 16.98,59.05
N$435  (via drill 0.6 pad 1.52)
  other vias: 15.71,60.32
N$436  (via drill 0.6 pad 1.52)
  other vias: 13.17,62.86
N$437  (via drill 0.6 pad 1.52)
  Top 0.254: v10.63,65.41 v10.63,67.95
N$438  (via drill 0.6 pad 1.52)
  other vias: 10.63,62.86
N$440  (via drill 0.6 pad 1.52)
  Bottom 0.254: v9.36,66.68 v11.9,66.68
N$441  (via drill 0.6 pad 1.52)
  other vias: 9.36,69.22
N$442  (via drill 0.6 pad 1.52)
  other vias: 13.17,60.32
N$443  (via drill 0.6 pad 1.52)
  other vias: 14.44,59.05
N$444  (via drill 0.6 pad 1.52)
  other vias: 15.71,57.78
N$446  (via drill 0.6 pad 1.52)
  Bottom 0.254: v16.98,53.98 v19.52,53.98
N$449  (via drill 0.6 pad 1.52)
  other vias: 13.17,57.78
N$450  (via drill 0.6 pad 1.52)
  other vias: 11.9,59.05
N$451  (via drill 0.6 pad 1.52)
  other vias: 10.63,60.32
N$452  (via drill 0.6 pad 1.52)
  Bottom 0.254: v9.36,56.52 v9.36,61.59
N$453  (via drill 0.6 pad 1.52)
  Top 0.254: v8.09,62.86 v8.09,65.41
N$455  (via drill 0.6 pad 1.52)
  Bottom 0.254: v6.82,64.14 v9.36,64.14
N$457  (via drill 0.6 pad 1.52)
  other vias: 6.82,69.22
N$458  (via drill 0.6 pad 1.52)
  Top 0.254: v5.55,65.41 v5.55,67.95
N$459  (via drill 0.6 pad 1.52)
  Bottom 0.254: v4.28,66.68 v6.82,66.68
N$460  (via drill 0.6 pad 1.52)
  other vias: 4.28,69.22
N$463  (via drill 0.6 pad 1.52)
  Bottom 0.254: v9.36,71.76 v11.9,71.76
N$464  (via drill 0.6 pad 1.52)
  Bottom 0.254: v9.36,74.3 v22.06,74.3
N$469  (via drill 0.6 pad 1.52)
  Bottom 0.254: v1.74,69.22 v22.06,69.22
N$470  (via drill 0.6 pad 1.52)
  other vias: 1.74,66.68
N$472  (via drill 0.6 pad 1.52)
  Bottom 0.254: v9.36,76.84 v11.9,76.84
N$475  (via drill 0.6 pad 1.52)
  Bottom 0.254: v1.74,64.14 v4.28,64.14
N$476  (via drill 0.6 pad 1.52)
  Bottom 0.254: v1.74,56.52 v1.74,61.59
N$477  (via drill 0.6 pad 1.52)
  other vias: 1.74,59.05
N$479  (via drill 0.6 pad 1.52)
  Bottom 0.254: v1.74,53.98 v4.28,53.98
N$482  (via drill 0.6 pad 1.52)
  Bottom 0.254: v1.74,46.35 v24.6,46.35
N$483  (via drill 0.6 pad 1.52)
  Bottom 0.254: v1.74,43.81 v4.28,43.81
N$485  (via drill 0.6 pad 1.52)
  other vias: 1.74,38.73
N$486  (via drill 0.6 pad 1.52)
  Bottom 0.254: v1.74,36.2 v1.74,41.27
N$487  (via drill 0.6 pad 1.52)
  Bottom 0.254: v1.74,33.66 v4.28,33.66
N$488  (via drill 0.6 pad 1.52)
  Bottom 0.254: v1.74,31.12 v24.6,31.12
N$489  (via drill 0.6 pad 1.52)
  Bottom 0.254: v1.74,28.58 v4.28,28.58
N$491  (via drill 0.6 pad 1.52)
  Bottom 0.254: v1.74,23.5 v1.74,26.04
N$492  (via drill 0.6 pad 1.52)
  Bottom 0.254: v1.74,20.96 v4.28,20.96
N$493  (via drill 0.6 pad 1.52)
  Bottom 0.254: v1.74,18.42 v4.28,18.42
N$494  (via drill 0.6 pad 1.52)
  Bottom 0.254: v1.74,15.88 v4.28,15.88
N$496  (via drill 0.6 pad 1.52)
  Bottom 0.254: v1.74,10.79 v1.74,13.33
N$497  (via drill 0.6 pad 1.52)
  Top 0.254: v3.01,12.06 v5.55,12.06
N$498  (via drill 0.6 pad 1.52)
  Bottom 0.254: v4.28,10.79 v4.28,13.33
N$503  (via drill 0.6 pad 1.52)
  Bottom 0.254: v4.28,23.5 v4.28,26.04
N$505  (via drill 0.6 pad 1.52)
  Bottom 0.254: v4.28,56.52 v4.28,61.59
N$506  (via drill 0.6 pad 1.52)
  other vias: 4.28,59.05
N$509  (via drill 0.6 pad 1.52)
  other vias: 4.28,51.43
N$510  (via drill 0.6 pad 1.52)
  Bottom 0.254: v1.74,48.89 v4.28,48.89
N$511  (via drill 0.6 pad 1.52)
  other vias: 4.28,46.35
N$513  (via drill 0.6 pad 1.52)
  Bottom 0.254: v4.28,36.2 v4.28,41.27
N$514  (via drill 0.6 pad 1.52)
  other vias: 4.28,38.73
N$517  (via drill 0.6 pad 1.52)
  other vias: 4.28,31.12
N$520  (via drill 0.6 pad 1.52)
  other vias: 5.55,24.77
N$521  (via drill 0.6 pad 1.52)
  Bottom 0.254: v6.82,23.5 v6.82,26.04
N$522  (via drill 0.6 pad 1.52)
  Bottom 0.254: v9.36,23.5 v9.36,26.04
N$523  (via drill 0.6 pad 1.52)
  Bottom 0.254: v11.9,23.5 v11.9,26.04
N$524  (via drill 0.6 pad 1.52)
  Bottom 0.254: v14.44,23.5 v14.44,26.04
N$525  (via drill 0.6 pad 1.52)
  Bottom 0.254: v16.98,23.5 v16.98,26.04
N$526  (via drill 0.6 pad 1.52)
  Bottom 0.254: v19.52,23.5 v19.52,26.04
N$527  (via drill 0.6 pad 1.52)
  Bottom 0.254: v22.06,23.5 v22.06,26.04
N$528  (via drill 0.6 pad 1.52)
  Bottom 0.254: v24.6,23.5 v24.6,26.04
N$529  (via drill 0.6 pad 1.52)
  Bottom 0.254: v27.14,23.5 v27.14,26.04
N$531  (via drill 0.6 pad 1.52)
  other vias: 27.14,28.58
N$532  (via drill 0.6 pad 1.52)
  other vias: 25.87,29.85
N$535  (via drill 0.6 pad 1.52)
  Top 0.305: v23.33,32.38 v23.33,34.92
N$536  (via drill 0.6 pad 1.52)
  Bottom 0.254: v22.06,36.2 v22.06,41.27
N$537  (via drill 0.6 pad 1.52)
  other vias: 22.06,33.66
N$538  (via drill 0.6 pad 1.52)
  other vias: 22.06,31.12
N$541  (via drill 0.6 pad 1.52)
  other vias: 25.87,27.31
N$542  (via drill 0.6 pad 1.52)
  other vias: 25.87,24.77
N$544  (via drill 0.6 pad 1.52)
  other vias: 20.79,24.77
N$545  (via drill 0.6 pad 1.52)
  other vias: 18.25,24.77
N$546  (via drill 0.6 pad 1.52)
  other vias: 15.71,24.77
N$547  (via drill 0.6 pad 1.52)
  other vias: 13.17,24.77
N$548  (via drill 0.6 pad 1.52)
  other vias: 10.63,24.77
N$549  (via drill 0.6 pad 1.52)
  other vias: 8.09,24.77
N$551  (via drill 0.6 pad 1.52)
  Top 0.254: v5.55,27.31 v5.55,29.85
N$558  (via drill 0.6 pad 1.52)
  Bottom 0.254: v22.06,28.58 v24.6,28.58
N$559  (via drill 0.6 pad 1.52)
  Top 0.254: v23.33,27.31 v23.33,29.85
N$561  (via drill 0.6 pad 1.52)
  Top 0.254: v20.79,27.31 v20.79,29.85
N$562  (via drill 0.6 pad 1.52)
  Top 0.254: v18.25,27.31 v18.25,29.85
N$563  (via drill 0.6 pad 1.52)
  Top 0.254: v15.71,27.31 v15.71,29.85
N$564  (via drill 0.6 pad 1.52)
  Top 0.254: v13.17,27.31 v13.17,29.85
N$565  (via drill 0.6 pad 1.52)
  Top 0.254: v10.63,27.31 v10.63,29.85
N$566  (via drill 0.6 pad 1.52)
  Top 0.254: v8.09,27.31 v8.09,29.85
N$567  (via drill 0.6 pad 1.52)
  Bottom 0.254: v6.82,28.58 v9.36,28.58
N$570  (via drill 0.6 pad 1.52)
  Bottom 0.254: v11.9,28.58 v14.44,28.58
N$572  (via drill 0.6 pad 1.52)
  Bottom 0.254: v16.98,28.58 v19.52,28.58
N$580  (via drill 0.6 pad 1.52)
  other vias: 6.82,31.12
N$581  (via drill 0.6 pad 1.52)
  Top 0.254: v5.55,32.38 v5.55,34.92
N$582  (via drill 0.6 pad 1.52)
  other vias: 9.36,31.12
N$583  (via drill 0.6 pad 1.52)
  other vias: 11.9,31.12
N$584  (via drill 0.6 pad 1.52)
  other vias: 14.44,31.12
N$585  (via drill 0.6 pad 1.52)
  other vias: 16.98,31.12
N$586  (via drill 0.6 pad 1.52)
  other vias: 19.52,31.12
N$587  (via drill 0.6 pad 1.52)
  Top 0.305: v20.79,32.38 v20.79,34.92
N$588  (via drill 0.6 pad 1.52)
  Top 0.305: v18.25,32.38 v18.25,34.92
N$589  (via drill 0.6 pad 1.52)
  Top 0.254: v15.71,32.38 v15.71,34.92
N$590  (via drill 0.6 pad 1.52)
  Top 0.254: v13.17,32.38 v13.17,34.92
N$591  (via drill 0.6 pad 1.52)
  Top 0.254: v10.63,32.38 v10.63,34.92
N$592  (via drill 0.6 pad 1.52)
  Top 0.254: v8.09,32.38 v8.09,34.92
N$593  (via drill 0.6 pad 1.52)
  Bottom 0.254: v6.82,33.66 v9.36,33.66
N$595  (via drill 0.6 pad 1.52)
  other vias: 5.55,37.46
N$596  (via drill 0.6 pad 1.52)
  other vias: 5.55,40
N$597  (via drill 0.6 pad 1.52)
  Top 0.305: v5.55,42.54 v5.55,45.09
N$605  (via drill 0.6 pad 1.52)
  Top 0.305: v20.79,42.54 v20.79,45.09
N$606  (via drill 0.6 pad 1.52)
  other vias: 20.79,40
N$607  (via drill 0.6 pad 1.52)
  other vias: 20.79,37.46
N$610  (via drill 0.6 pad 1.52)
  Bottom 0.254: v16.98,33.66 v19.52,33.66
N$612  (via drill 0.6 pad 1.52)
  Bottom 0.254: v11.9,33.66 v14.44,33.66
N$615  (via drill 0.6 pad 1.52)
  Bottom 0.254: v6.82,36.2 v6.82,41.27
N$616  (via drill 0.6 pad 1.52)
  other vias: 6.82,38.73
N$618  (via drill 0.6 pad 1.52)
  Bottom 0.254: v6.82,43.81 v9.36,43.81
N$620  (via drill 0.6 pad 1.52)
  Bottom 0.254: v11.9,43.81 v14.44,43.81
N$622  (via drill 0.6 pad 1.52)
  Bottom 0.254: v16.98,43.81 v19.52,43.81
N$625  (via drill 0.6 pad 1.52)
  other vias: 19.52,38.73
N$626  (via drill 0.6 pad 1.52)
  Bottom 0.254: v19.52,36.2 v19.52,41.27
N$631  (via drill 0.6 pad 1.52)
  Bottom 0.254: v9.36,36.2 v9.36,41.27
N$632  (via drill 0.6 pad 1.52)
  other vias: 8.09,37.46
N$633  (via drill 0.6 pad 1.52)
  other vias: 8.09,40
N$634  (via drill 0.6 pad 1.52)
  Top 0.305: v8.09,42.54 v8.09,45.09
N$635  (via drill 0.6 pad 1.52)
  Top 0.305: v10.63,42.54 v10.63,45.09
N$636  (via drill 0.6 pad 1.52)
  other vias: 10.63,40
N$637  (via drill 0.6 pad 1.52)
  other vias: 10.63,37.46
N$638  (via drill 0.6 pad 1.52)
  other vias: 13.17,37.46
N$639  (via drill 0.6 pad 1.52)
  other vias: 13.17,40
N$640  (via drill 0.6 pad 1.52)
  Top 0.305: v13.17,42.54 v13.17,45.09
N$642  (via drill 0.6 pad 1.52)
  other vias: 11.9,38.73
N$643  (via drill 0.6 pad 1.52)
  Bottom 0.254: v11.9,36.2 v11.9,41.27
N$644  (via drill 0.6 pad 1.52)
  other vias: 9.36,38.73
N$646  (via drill 0.6 pad 1.52)
  Top 0.305: v18.25,42.54 v18.25,45.09
N$647  (via drill 0.6 pad 1.52)
  other vias: 18.25,40
N$648  (via drill 0.6 pad 1.52)
  other vias: 18.25,37.46
N$649  (via drill 0.6 pad 1.52)
  Bottom 0.254: v16.98,36.2 v16.98,41.27
N$650  (via drill 0.6 pad 1.52)
  Bottom 0.254: v14.44,36.2 v14.44,41.27
N$651  (via drill 0.6 pad 1.52)
  other vias: 14.44,38.73
N$653  (via drill 0.6 pad 1.52)
  Top 0.305: v15.71,42.54 v15.71,45.09
N$655  (via drill 0.6 pad 1.52)
  other vias: 16.98,38.73
N$656  (via drill 0.6 pad 1.52)
  other vias: 15.71,37.46
N$657  (via drill 0.6 pad 1.52)
  other vias: 15.71,40
N$658  (via drill 0.6 pad 1.52)
  other vias: 19.52,46.35
N$659  (via drill 0.6 pad 1.52)
  Top 0.305: v20.79,47.62 v20.79,50.16
N$660  (via drill 0.6 pad 1.52)
  Bottom 0.254: v16.98,48.89 v19.52,48.89
N$661  (via drill 0.6 pad 1.52)
  Top 0.305: v18.25,47.62 v18.25,50.16
N$662  (via drill 0.6 pad 1.52)
  other vias: 16.98,46.35
N$665  (via drill 0.6 pad 1.52)
  other vias: 16.98,51.43
N$667  (via drill 0.6 pad 1.52)
  Top 0.305: v15.71,47.62 v15.71,50.16
N$668  (via drill 0.6 pad 1.52)
  other vias: 14.44,46.35
N$669  (via drill 0.6 pad 1.52)
  Bottom 0.254: v11.9,48.89 v14.44,48.89
N$670  (via drill 0.6 pad 1.52)
  Top 0.305: v15.71,52.7 v15.71,55.24
N$671  (via drill 0.6 pad 1.52)
  other vias: 14.44,51.43
N$673  (via drill 0.6 pad 1.52)
  Top 0.305: v13.17,47.62 v13.17,50.16
N$674  (via drill 0.6 pad 1.52)
  other vias: 11.9,46.35
N$676  (via drill 0.6 pad 1.52)
  other vias: 11.9,51.43
N$677  (via drill 0.6 pad 1.52)
  Bottom 0.254: v11.9,53.98 v14.44,53.98
N$681  (via drill 0.6 pad 1.52)
  Top 0.305: v13.17,52.7 v13.17,55.24
N$682  (via drill 0.6 pad 1.52)
  Top 0.305: v5.55,47.62 v5.55,50.16
N$685  (via drill 0.6 pad 1.52)
  Top 0.305: v5.55,52.7 v5.55,55.24
N$687  (via drill 0.6 pad 1.52)
  other vias: 5.55,60.32
N$688  (via drill 0.6 pad 1.52)
  other vias: 5.55,62.86
N$689  (via drill 0.6 pad 1.52)
  Bottom 0.254: v6.82,56.52 v6.82,61.59
N$690  (via drill 0.6 pad 1.52)
  other vias: 6.82,59.05
N$692  (via drill 0.6 pad 1.52)
  Bottom 0.254: v6.82,53.98 v9.36,53.98
N$693  (via drill 0.6 pad 1.52)
  other vias: 6.82,51.43
N$695  (via drill 0.6 pad 1.52)
  other vias: 6.82,46.35
N$696  (via drill 0.6 pad 1.52)
  Top 0.305: v8.09,47.62 v8.09,50.16
N$698  (via drill 0.6 pad 1.52)
  Top 0.305: v8.09,52.7 v8.09,55.24
N$700  (via drill 0.6 pad 1.52)
  other vias: 8.09,57.78
N$701  (via drill 0.6 pad 1.52)
  other vias: 8.09,60.32
N$702  (via drill 0.6 pad 1.52)
  other vias: 9.36,59.05
N$705  (via drill 0.6 pad 1.52)
  other vias: 9.36,51.43
N$706  (via drill 0.6 pad 1.52)
  Bottom 0.254: v6.82,48.89 v9.36,48.89
N$707  (via drill 0.6 pad 1.52)
  other vias: 9.36,46.35
N$708  (via drill 0.6 pad 1.52)
  Top 0.305: v10.63,47.62 v10.63,50.16
N$710  (via drill 0.6 pad 1.52)
  Top 0.305: v10.63,52.7 v10.63,55.24
N$712  (via drill 0.6 pad 1.52)
  other vias: 10.63,57.78
NRST  (via drill 0.6 pad 1.42)
  Top 0.254: U1.39 34.7,24.2 v34.12,24.77
  Bottom 0.254: 26.5,19.05 26.52,19.06 R14.2 26.52,18.9 26.5,18.89 26.82,18.58 | JP14.1 26.5,17.15 | 29.68,23.5 30.95,24.77 v34.12,24.77 | 29.52,17.15
  Bottom 0.406: JP11.1 29.52,17.15 29.68,17.3 29.68,23.5 | 26.82,18.58 JP14.1 29.52,17.15
PA0
  Top 0.254: SV1.1 26.34,33.43 28.4,31.38 28.4,25.4 | 28.4,25.4 28.4,25.3 | U1.48 37.3,18.69 37.3,17.78 36.66,17.15 33.9,17.15 32.75,18.3 32.75,19.89 32.08,20.56 29.44,20.56 28.4,21.6 28.4,25.39 28.41,25.4 28.4,25.4
  Top 0.305: 26.34,38.1 25.08,36.83 25.08,35.72 26.35,34.45 26.35,33.97 26.34,33.97 SV1.1 | SV2.1 24.6,54.56 24.6,66.68 25.87,67.95 26.5,67.95 SV7.1
  Top 0.61: 26.34,38.1 SV2.1
PA1
  Top 0.254: 29.07,31.6 27.64,33.03 arc45 27.66,33.04 27.68,33.06 arc-45 27.64,33.16 27.64,34.42 26.41,35.65 arc-45 26.34,35.83 SV1.2 | 29.07,31.6 29.09,31.59 | U1.47 37.66,20.19 36.67,19.2 36.67,19.15 36.66,19.14 36.66,19.06 36.66,19.05 36.66,17.78 33.98,17.78 33.29,18.48 33.29,20.06 32.22,21.12 29.63,21.12 29.18,21.58 29.18,31.57 29.11,31.64 29.07,31.6
  Top 0.305: SV1.2 26.35,37.15 27.62,38.42 27.62,53.5 26.34,54.77 SV2.2 26.5,55.52 26.5,66.04 27.77,67.31 27.77,69.22 26.5,70.48 SV7.2
PA2
  Top 0.254: 28.81,33.82 28.78,33.85 | 28.81,33.82 SV1.3 | 28.81,33.82 28.98,33.66 28.98,32.68 29.89,31.78 29.89,21.7 U1.44
  Top 0.305: 28.88,38.1 27.62,36.83 27.62,35.72 28.89,34.45 28.89,33.97 28.88,33.97 SV1.3 | SV2.3 28.89,53.5 27.62,54.77 27.62,65.88 29.04,67.31 29.04,67.95 SV7.3 29.04,67.79
  Top 0.61: 28.88,38.1 SV2.3
PA3
  Top 0.254: 30.17,32.88 30.56,32.48 30.56,22.2 U1.43 | 30.17,32.88 30.14,32.91 | SV1.4 28.93,36.36 28.95,36.38 28.95,35.66 30.16,34.45 30.16,32.86 30.17,32.88
  Top 0.305: SV1.4 28.89,36.99 30.16,38.26 30.16,53.66 28.88,54.93 SV2.4 28.88,65.88 30.31,67.31 30.31,69.22 29.04,70.49 SV7.4
PA4
  Top 0.254: U1.36 36.82,25.7 35.62,26.9 35.62,30.04 33.73,31.93 33.14,31.93 31.42,33.64 SV1.5 | SV1.5 31.43,34.29 30.16,35.56 30.16,36.83
  Top 0.305: 30.16,36.83 31.42,38.1 | SV1.5 | SV2.5 31.42,53.5 30.16,54.77 30.16,65.72 31.43,66.99 31.43,67.79 31.58,67.95 SV7.5
  Top 0.61: 31.42,38.1 SV2.5
PA5
  Top 0.254: U1.35 37.09,26.2 36.3,26.99 36.3,30.3 33.99,32.6 33.41,32.6 32.69,33.33 | 32.69,33.33 32.67,33.34 | SV1.6 31.42,35.73 32.7,34.45 32.7,33.34 32.69,33.33
  Top 0.305: SV1.6 31.42,36.82 32.7,38.1 32.7,53.66 31.42,54.93 SV2.6 31.42,65.56 32.85,66.99 32.85,69.22 31.58,70.49 SV7.6
PA6
  Top 0.254: U1.34 37.36,26.7 36.94,27.12 36.94,30.52 33.96,33.49 SV1.7
  Top 0.305: 33.96,38.1 32.7,36.83 32.7,35.72 33.97,34.45 SV1.7 | SV2.7 33.96,53.5 32.7,54.77 32.7,65.41 34.12,66.83 34.12,67.95 SV7.7
  Top 0.61: 33.96,38.1 SV2.7
PA7
  Top 0.254: U1.32 40.26,29.69 38.64,31.31 37.97,31.31 36.81,32.46 36.08,32.46 35.23,33.31 35.23,34.61 33.96,35.88 SV1.8 33.93,36.38
  Top 0.305: 33.93,36.38 33.93,36.95 35.08,38.1 35.08,53.5 33.97,54.61 33.97,55.24 33.96,55.25 SV2.8 33.96,55.4 33.97,55.4 33.97,65.41 35.39,66.83 35.39,69.22 34.12,70.49 SV7.8
PA8
  Top 0.254: U1.31 40.76,30 38.81,31.95 38.22,31.95 36.5,33.66 SV1.9 36.48,33.81 | 35.24,36.04 35.24,35.72 36.51,34.45 SV1.9
  Top 0.305: 36.5,38.1 35.24,36.83 35.24,36.04 | SV1.9 | 36.5,52.68 36.51,52.67 | SV2.9 36.5,52.68 | 36.5,52.68 36.46,52.73 36.46,53.39 35.24,54.61 35.24,65.41 36.66,66.83 36.66,67.95 SV7.9
  Top 0.61: 36.5,38.1 SV2.9
PA9
  Top 0.254: U1.30 41.26,30.27 39.01,32.52 38.63,32.52 37.79,33.35 37.79,34.43 36.51,35.72 36.51,36.04 36.5,36.04 SV1.10 36.5,36.41
  Top 0.305: SV2.10 36.55,55.36 | SV1.10 36.5,36.82 37.78,38.1 37.78,53.34 36.51,54.61 36.51,55.4 36.5,55.4 SV2.10 | SV2.10 36.5,65.4 37.94,66.83 37.94,69.22 36.66,70.49 SV7.10
PA10
  Top 0.254: SV1.11 39.04,33.41 41.76,30.7 U1.29
  Top 0.305: 39.04,37.94 37.78,36.67 37.78,35.72 39.05,34.45 SV1.11 | SV2.11 39.04,53.34 37.78,54.61 37.78,65.41 39.2,66.83 39.2,67.95 SV7.11
  Top 0.61: 39.04,37.94 SV2.11
PA11
  Top 0.254: U1.28 42.26,31.2 40.31,33.14 40.31,33.17 40.32,33.18 40.32,34.61 39.04,35.88 SV1.12
  Top 0.305: SV1.12 39.04,36.66 40.32,37.94 40.32,53.34 39.05,54.61 39.05,55.4 39.04,55.4 SV2.12 39.04,65.4 40.48,66.83 40.48,69.22 39.2,70.49 SV7.12
PA12
  Top 0.254: U1.27 42.76,31.7 41.61,32.84 41.61,33.84 SV1.13 | 40.32,35.88 40.32,35.72 41.59,34.45 SV1.13
  Top 0.305: 41.58,38.1 40.32,36.83 40.32,35.88 | SV1.13 | SV2.13 41.58,53.34 40.32,54.61 40.32,65.25 41.74,66.68 41.74,67.95 SV7.13
  Top 0.61: 41.58,38.1 SV2.13
PA13
  Top 0.254: U1.22 45.26,30.86 42.84,33.27 42.84,34.46 41.59,35.72 SV1.14 41.56,36.36 41.54,36.34
  Top 0.305: SV2.14 41.63,55.36 | SV1.14 41.58,36.66 42.86,37.94 42.86,53.34 41.59,54.61 41.59,55.4 41.58,55.4 SV2.14 | SV2.14 41.58,65.24 43.02,66.68 43.02,69.22 41.74,70.49 SV7.14
PA14
  Top 0.254: U1.21 45.76,31.37 44.11,33.02 44.11,33.84 SV1.15
  Top 0.305: SV1.15 44.13,34.45 42.86,35.72 42.86,36.83 43.81,37.78 43.81,52.55 44.12,52.86 | SV7.15 44.28,67.95 44.28,66.68 42.86,65.25 42.86,54.61 44.12,53.34 SV2.15 44.12,52.86 | 44.12,52.86 44.13,52.86
PA15  (via drill 0.6)
  Top 0.254: U1.20 46.26,31.9 45.48,32.67 45.48,32.78 45.4,32.86 45.4,34.61 44.12,35.88 SV1.16
  Top 0.305: 44.17,55.36 SV2.16 44.12,55.25 44.13,55.24 44.13,54.61 45.4,53.34 45.4,52.23 44.76,51.59 44.76,36.99 SV1.16 | v44.13,55.4 44.13,65.41 45.55,66.83 45.55,69.22 44.28,70.49 SV7.16
  Bottom 0.305: 45.55,50.48 45.55,53.34 44.13,54.77 v44.13,55.4
  Bottom 0.406: JP8.1 86.83,44.61 84.92,46.51 49.52,46.51 45.55,50.48 | v44.13,55.4 v44.12,55.4 SV2.16
PA16  (via drill 0.6)  (1 unrouted)
  Top 0.254: U1.19 46.76,33.66 46.65,33.77 46.66,33.78 SV1.17 46.66,34.45 45.4,35.72 45.4,36.99
  Top 0.305: v46.67,52.86 v46.66,52.86 SV2.17 46.66,52.39 46.67,52.39 45.71,51.43 45.71,37.31 45.4,36.99 | v46.67,52.86 46.67,52.7 | v46.67,52.86 46.67,53.34 45.4,54.61 45.4,65.25 46.82,66.68 46.82,67.95 SV7.17
  Bottom 0.406: JP9.1 90,43.97 86.51,47.47 49.84,47.47 46.67,50.64 46.67,52.55 | SV2.17 46.71,52.82
PA17
  Top 0.254: SV1.18 46.73,36.36 | U1.9 49.72,23.68 | U1.9 | U1.9 49.69,23.71 48.37,23.71 47.77,24.31 47.77,27.91 47.79,27.91 48.86,28.98 49.94,28.98 51.45,30.49 51.45,31.44 51.3,31.59 50.53,31.59 49.55,32.56 48.55,32.56 47.94,33.18 47.94,34.61 46.82,35.72 46.82,36.2 SV1.18
  Top 0.305: SV1.18 46.67,51.12 47.94,52.39 47.94,53.34 46.67,54.61 46.67,55.24 46.66,55.25 SV2.18 46.66,65.24 48.09,66.68 48.09,69.22 46.82,70.49 SV7.18
PA18
  Top 0.254: SV1.19 49.93,33.09 49.92,33.09 50.84,32.17 51.81,32.17 52.02,31.96 52.02,30.21 50.2,28.4 48.96,28.4 48.23,27.67 48.23,24.56 48.59,24.2 49.63,24.2 49.64,24.19 49.65,24.2 U1.10 | SV2.19 49.2,52.55 49.21,52.55 47.94,51.28 47.94,35.88
  Top 0.305: SV1.19 49.2,34.61 47.94,35.88 | SV2.19 49.2,52.86 49.21,52.86 49.21,53.34 47.94,54.61 47.94,65.25 49.37,66.68 49.37,67.95 49.36,67.95 SV7.19
PA19  (via drill 0.6 pad 1.68)
  Top 0.254: U1.13 49.1,25.7 48.79,26.01 48.79,27.46 49.16,27.84 50.41,27.84 52.56,29.99 52.56,32.15 52.1,32.6 51.15,32.6 50.52,33.23 50.52,34.34 50.5,34.34 49.2,35.63 49.2,36.34 | 49.2,36.34 SV1.20 | 49.2,36.34 49.19,36.34
  Top 0.305: SV2.20 49.2,55.25 | SV1.20 v49.21,50.27 v49.2,50.27
  Bottom 0.305: v49.2,50.27 49.2,51.09 50.45,52.34 50.45,53.45 49.17,54.73 49.17,55.36 49.18,55.38 SV2.20 49.2,65.57 48.09,66.68 48.09,69.22 49.37,70.48 49.36,70.49 SV7.20
PA20
  Top 0.254: U1.16 50.54,27.2 53.09,29.75 53.09,32.53 51.79,33.84 SV1.21 | SV1.21 51.72,33.84 | SV1.21
  Top 0.305: SV1.21 51.73,34.59 53.02,35.88 53.02,50.96 51.75,52.23 51.75,52.86 | 51.75,52.86 51.74,52.86 SV2.21 | 51.75,52.86 51.75,53.34 53.02,54.61 53.02,65.41 51.91,66.52 51.91,67.95 51.9,67.95 SV7.21 51.9,68.1 51.91,68.1
PA21  (via drill 0.6 pad 1.42)
  Top 0.254: U1.11 50.38,24.7 50.81,25.12 52.9,25.12 53.17,25.4 53.17,25.92 53.9,26.65 55.64,26.65 55.95,26.96 55.95,28.14 57.04,29.23 v57.07,28.91